# EAGLE design 7segement4minidigits1badidea-max7219-smd-mk-1.0 (EAGLE 6.5.0)
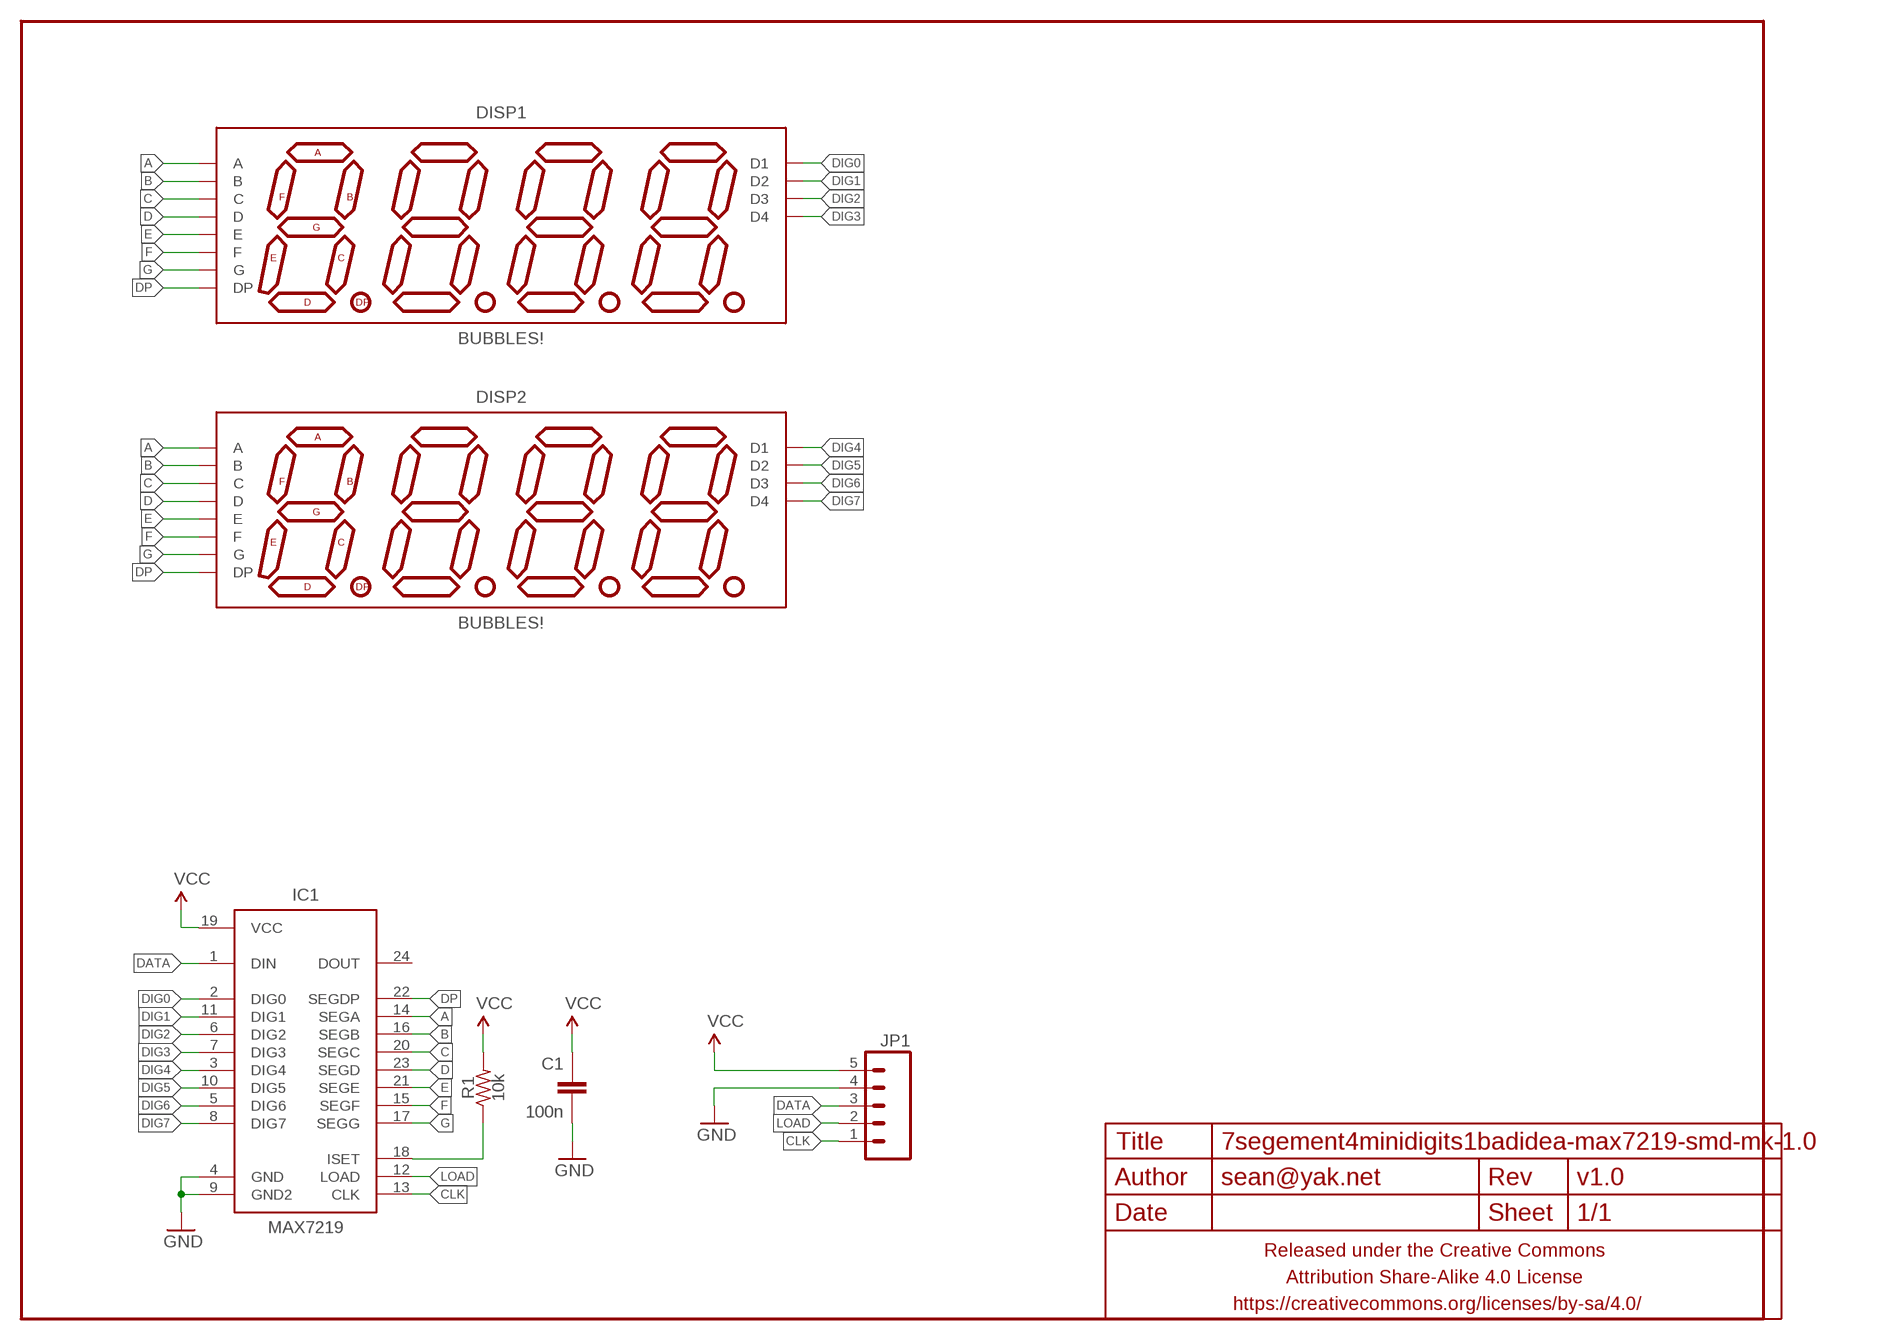
[diagram p0: schematic, sheet 1]

## Parts
C1  100n  CAPACITOR-CERAMICC0603  [C0603]
DISP1  BUBBLES!  7SEG_4DIGITHP-BUBBLE  [DIL12]
DISP2  BUBBLES!  7SEG_4DIGITHP-BUBBLE  [DIL12]
FRAME1  FRAME-LETTERNO_PACKAGE  [DUMMY]
IC1  MAX7219  MAX7219SOIC-W  [SO24W]
JP1  M05PTH-CENTERED  [1X05_PTH_CENTERED]
R1  10k  RESISTORR0603  [R0603]

## Nets
A: DISP1.12(A) DISP2.12(A) IC1.14(SEGA)
B: DISP1.11(B) DISP2.11(B) IC1.16(SEGB)
C: DISP1.3(C) DISP2.3(C) IC1.20(SEGC)
CLK: IC1.13(CLK) JP1.1
D: DISP1.8(D) DISP2.8(D) IC1.23(SEGD)
DATA: IC1.1(DIN) JP1.3
DIG0: DISP1.1(D1) IC1.2(DIG0)
DIG1: DISP1.10(D2) IC1.11(DIG1)
DIG2: DISP1.4(D3) IC1.6(DIG2)
DIG3: DISP1.6(D4) IC1.7(DIG3)
DIG4: DISP2.1(D1) IC1.3(DIG4)
DIG5: DISP2.10(D2) IC1.10(DIG5)
DIG6: DISP2.4(D3) IC1.5(DIG6)
DIG7: DISP2.6(D4) IC1.8(DIG7)
DP: DISP1.5(DP) DISP2.5(DP) IC1.22(SEGDP)
E: DISP1.2(E) DISP2.2(E) IC1.21(SEGE)
F: DISP1.9(F) DISP2.9(F) IC1.15(SEGF)
G: DISP1.7(G) DISP2.7(G) IC1.17(SEGG)
GND: C1.2 IC1.4(GND) IC1.9(GND2) JP1.4
LOAD: IC1.12(LOAD) JP1.2
N$1: IC1.18(ISET) R1.1
VCC: C1.1 IC1.19(VCC) JP1.5 R1.2
Unconnected: IC1.24(DOUT)

## Library data of the parts
C1 = A_butts:CAPACITOR-CERAMIC: CAPACITOR, European symbol
DISP1 DISP2 = A_butts:7SEG_4DIGIT; STOREFRONT: COM-12710
FRAME1 = A_butts:FRAME-LETTER: Schematic Frame Standard 8.5x11 US Letter frame; DESIGNER: sean@yak.net; VERSION: v1.0
IC1 = A_butts:MAX7219: 8-digit, 8-segment LED display driver, serial input
JP1 = A_butts:M05: Header 5 Standard 5-pin 0.1" header. Use with straight break away headers (SKU : PRT-00116), right angle break away headers (PRT-00553), swiss pins (PRT-00743), machine pins (PRT-00117), and female headers (PRT-00115). Molex polarized connector foot print use with SKU : PRT-08230 with associated crimp pins and housings.
R1 = A_butts:RESISTOR: RESISTOR, American symbol

## Board
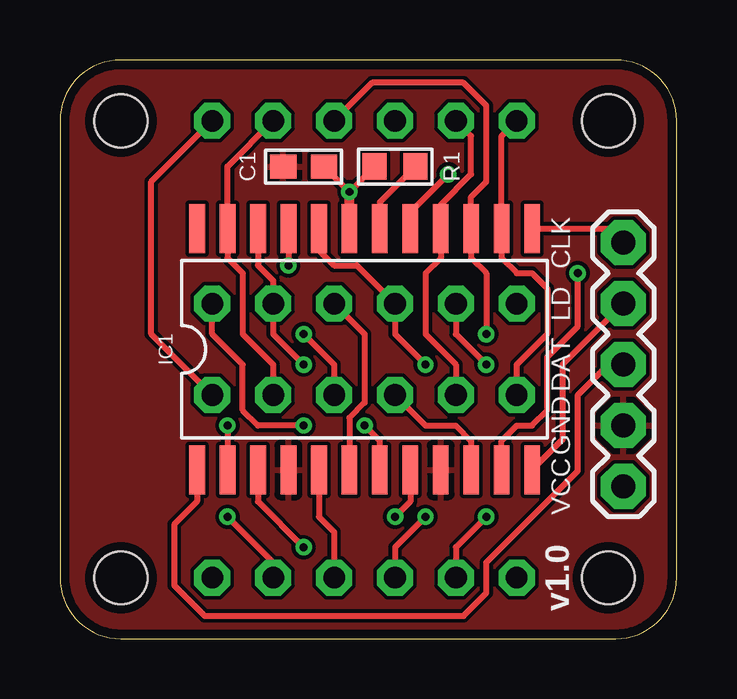
[diagram p1: board, top side]
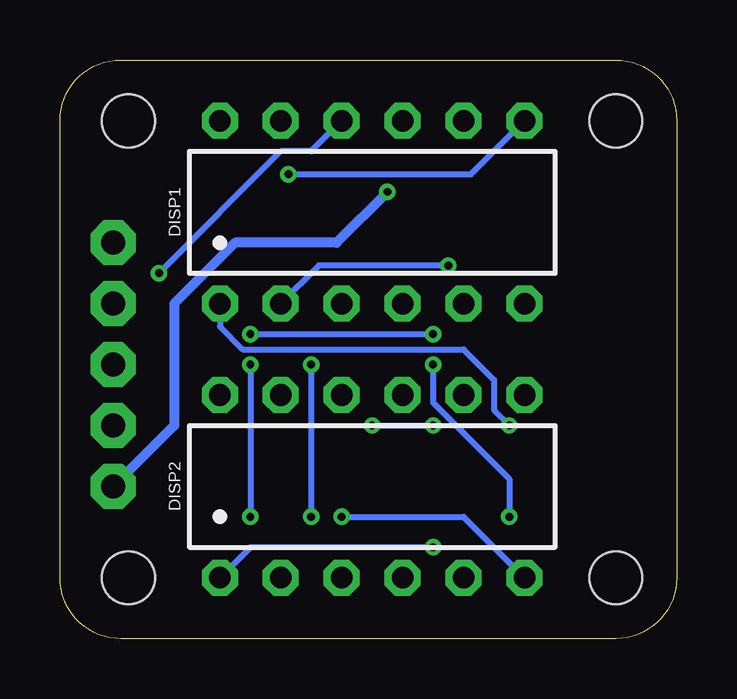
[diagram p2: board, bottom side, seen from below]

Size 25.72 x 24.13 mm. Coordinates in mm from the lower left corner, seen from the top.
Outline: 0,21.59 0,2.54 arc90 2.54,0 23.18,0 arc90 25.72,2.54 25.72,21.59 arc90 23.18,24.13 2.54,24.13 arc90 0,21.59
Copper layers (1*16): Top 0.0356mm / dielectric 1.5011mm / Bottom 0.0356mm
Design rules "LaenPCBOrder2": minimum track width 6mil, minimum drill 13mil, track to track 6mil, track to pad 6mil, pad to pad 6mil, via to via 6mil, smd to smd 6mil, copper to edge 15mil, drill to drill 6mil, minimum pad ring 7mil, minimum via ring 7mil, stop-mask expansion 3mil, vias tented up to drill 20mil, thermal gap 10mil
Holes 2.2 mm at 2.54,21.59 2.54,2.54 22.86,2.54 22.86,21.59

### Footprints (pad centres in the part's own frame; a part is rotated, then mirrored left to right if it is on the bottom)
C0603 = smd 1.1 x 1: 1 -0.85,0; 2 0.85,0
DIL12 = drill 0.9 pad 1.5 octagon: 1 -6.35,-3.81; 2 -3.81,-3.81; 3 -1.27,-3.81; 4 1.27,-3.81; 5 3.81,-3.81; 6 6.35,-3.81; 7 6.35,3.81; 8 3.81,3.81; 9 1.27,3.81; 10 -1.27,3.81; 11 -3.81,3.81; 12 -6.35,3.81
SO24W = smd 0.66 x 2.032: 1 -6.985,-5.029; 2 -5.715,-5.029; 3 -4.445,-5.029; 4 -3.175,-5.029; 5 -1.905,-5.029; 6 -0.635,-5.029; 7 0.635,-5.029; 8 1.905,-5.029; 9 3.175,-5.029; 10 4.445,-5.029; 11 5.715,-5.029; 12 6.985,-5.029; 13 6.985,5.029; 14 5.715,5.029; 15 4.445,5.029; 16 3.175,5.029; 17 1.905,5.029; 18 0.635,5.029; 19 -0.635,5.029; 20 -1.905,5.029; 21 -3.175,5.029; 22 -4.445,5.029; 23 -5.715,5.029; 24 -6.985,5.029
1X05_PTH_CENTERED = drill 1 pad 1.88 octagon: 1 -5.08,0; 2 -2.54,0; 3 0,0; 4 2.54,0; 5 5.08,0
R0603 = smd 1 x 1.1: 1 -0.85,0; 2 0.85,0

### Placement (x,y rotation side)
C1  10.16,19.68 180 top
DISP1  12.7,17.78 0 bottom
DISP2  12.7,6.35 0 bottom
FRAME1  0,0 0 top
IC1  12.7,12.06 0 top
JP1  23.5,11.43 270 top
R1  13.97,19.68 180 top

### Tracks (layer width: path | path; a pad name or v marks a point on that pad's centre or on a via)
A
  Top 0.254: DISP1.12 18.41,20.95 IC1.14 18.41,15.88 19.05,15.24 19.68,15.24 20.32,14.61 20.32,12.7 19.05,11.43 DISP2.12
B
  Top 0.254: DISP1.11 17.14,20.95 17.14,19.37 15.88,18.1 IC1.16 15.88,15.88 15.24,15.24 15.24,12.7 16.51,11.43 DISP2.11
C  (via drill 0.33)
  Top 0.254: IC1.20 10.79,16.19 11.43,15.56 12.38,15.56 DISP1.3 13.97,12.7 v15.24,11.43 | v15.24,5.08 13.97,3.81 DISP2.3
  Bottom 0.254: v15.24,11.43 v15.24,5.08
CLK
  Top 0.254: IC1.13 22.91,17.09 JP1.1
D
  Top 0.254: DISP1.8 6.99,19.68 IC1.23 6.99,15.88 7.62,15.24 7.62,12.7 8.89,11.43 DISP2.8
DATA
  Top 0.254: IC1.1 5.71,5.71 4.76,4.76 4.76,2.22 6.03,0.95 16.83,0.95 17.78,1.91 17.78,3.17 21.59,6.99 21.59,10.16 22.86,11.43 JP1.3
DIG0  (via drill 0.33)
  Top 0.254: v6.99,8.89 IC1.2
  Bottom 0.254: DISP1.1 19.05,13.02 18.1,12.06 8.89,12.06 7.62,10.79 7.62,9.53 v6.99,8.89
DIG1  (via drill 0.33)
  Top 0.254: IC1.11 18.41,8.26 19.05,8.89 19.68,8.89 20.32,9.53 20.32,11.75 21.59,13.02 v21.59,15.24
  Bottom 0.254: DISP1.10 15.24,20.32 16.51,20.32 v21.59,15.24
DIG2
  Top 0.254: DISP1.4 12.7,12.7 12.7,9.84 12.06,9.21 IC1.6
DIG3  (via drill 0.33)
  Top 0.254: IC1.7 13.34,8.26 v12.7,8.89 | v10.16,8.89 8.26,8.89 7.62,9.53 7.62,11.43 6.35,12.7 DISP1.6
  Bottom 0.254: v12.7,8.89 v10.16,8.89
DIG4  (via drill 0.33)
  Top 0.254: IC1.3 8.26,5.71 v10.16,3.81
  Bottom 0.254: v10.16,3.81 17.78,3.81 DISP2.1
DIG5
  Top 0.254: DISP2.10 15.24,8.89 16.51,8.89 17.14,8.26 IC1.10
DIG6
  Top 0.254: IC1.5 10.79,5.08 11.43,4.45 DISP2.4
DIG7  (via drill 0.33)
  Top 0.254: IC1.8 14.61,5.71 v13.97,5.08
  Bottom 0.254: v13.97,5.08 8.89,5.08 DISP2.6
DP  (via drill 0.33)
  Top 0.254: IC1.22 8.26,15.56 8.89,14.92 DISP1.5 8.89,12.7 v10.16,11.43 | v6.99,5.08 8.89,3.17 DISP2.5
  Bottom 0.254: v10.16,11.43 10.16,9.84 6.99,6.67 v6.99,5.08
E  (via drill 0.33)
  Top 0.254: IC1.21 v9.53,15.56 | DISP1.2 16.51,12.7 v17.78,11.43 | v17.78,5.08 16.51,3.81 DISP2.2
  Bottom 0.254: v9.53,15.56 14.92,15.56 DISP1.2 | v17.78,11.43 v17.78,5.08
F  (via drill 0.33)
  Top 0.254: DISP1.9 13.02,23.18 16.83,23.18 17.78,22.23 17.78,19.05 17.14,18.41 IC1.15 17.14,15.88 17.78,15.24 v17.78,12.7 | v10.16,12.7 11.43,11.43 DISP2.9
  Bottom 0.254: v17.78,12.7 v10.16,12.7
G  (via drill 0.33)
  Top 0.254: IC1.17 14.61,17.78 v16.19,19.37 | DISP2.7 3.81,12.7 3.81,19.05 DISP1.7
  Bottom 0.254: v16.19,19.37 8.57,19.37 DISP1.7
GND
  pour Top: 23.18,0 2.54,0 arc-90 0,2.54 0,21.59 arc-90 2.54,24.13 23.18,24.13 arc-90 25.72,21.59 25.72,2.54 arc-90
LOAD
  Top 0.254: JP1.2 20.95,11.43 20.95,8.31 IC1.12
N$1
  Top 0.254: R1.1 13.34,18.2 IC1.18
VCC  (via drill 0.33)
  Top 0.254: C1.1 v12.06,18.63 R1.2
  Top 0.406: IC1.19 v12.06,18.63
  Bottom 0.406: v12.06,18.63 14.19,16.51 18.41,16.51 20.95,13.97 20.95,8.89 JP1.5

### Text on the board
tPlace: CLK | LD | DAT | GND | VCC